# Altium schematic sheet 心电检测与显示电路ascii.SchDoc
size A4
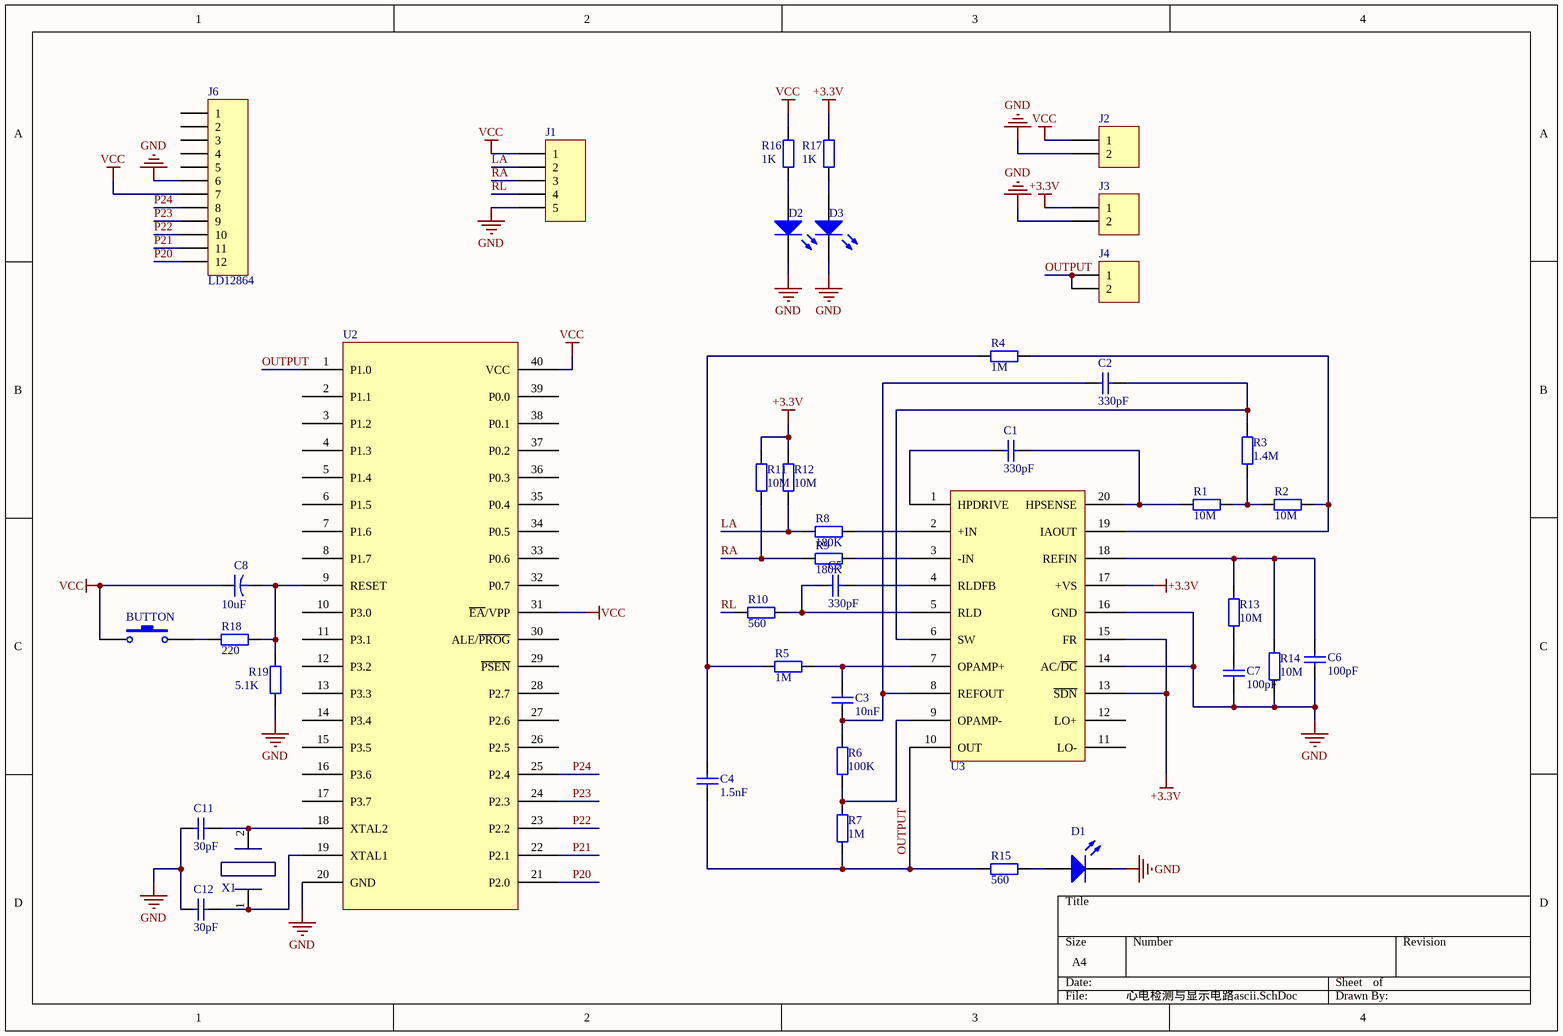
[diagram p0: 心电检测与显示电路ascii.SchDoc]

## Parts
BUTTON  SW-PB  [SPST-2]  (value not drawn)
C1  value 330pF  [RAD-0.3]  (hidden comment: Cap)
C2  value 330pF  [RAD-0.3]  (hidden comment: Cap)
C3  value 10nF  [RAD-0.3]  (hidden comment: Cap)
C4  value 1.5nF  [RAD-0.3]  (hidden comment: Cap)
C5  value 330pF  [RAD-0.3]  (hidden comment: Cap)
C6  value 100pF  [RAD-0.3]  (hidden comment: Cap)
C7  value 100pF  [RAD-0.3]  (hidden comment: Cap)
C8  value 10uF  [CAPR5-4X5]  (hidden comment: Cap2)
C11  value 30pF  [RAD-0.3]  (hidden comment: Cap)
C12  value 30pF  [RAD-0.3]  (hidden comment: Cap)
D1  LED1  [LED-1]  (value not drawn)
D2  LED1  [LED-1]  (value not drawn)
D3  LED1  [LED-1]  (value not drawn)
J1  MICROUSB  [HDR1X5]  (value not drawn)
J2  Header 2  [HDR1X2]  (value not drawn)
J3  Header 2  [HDR1X2]  (value not drawn)
J4  Header 2  [HDR1X2]  (value not drawn)
J6  LD12864  [HDR1X12]
R1  value 10M  [AXIAL-0.4]  (hidden comment: Res2)
R2  value 10M  [AXIAL-0.4]  (hidden comment: Res2)
R3  value 1.4M  [AXIAL-0.4]  (hidden comment: Res2)
R4  value 1M  [AXIAL-0.4]  (hidden comment: Res2)
R5  value 1M  [AXIAL-0.4]  (hidden comment: Res2)
R6  value 100K  [AXIAL-0.4]  (hidden comment: Res2)
R7  value 1M  [AXIAL-0.4]  (hidden comment: Res2)
R8  value 180K  [AXIAL-0.4]  (hidden comment: Res2)
R9  value 180K  [AXIAL-0.4]  (hidden comment: Res2)
R10  value 560  [AXIAL-0.4]  (hidden comment: Res2)
R11  value 10M  [AXIAL-0.4]  (hidden comment: Res2)
R12  value 10M  [AXIAL-0.4]  (hidden comment: Res2)
R13  value 10M  [AXIAL-0.4]  (hidden comment: Res2)
R14  value 10M  [AXIAL-0.4]  (hidden comment: Res2)
R15  value 560  [AXIAL-0.4]  (hidden comment: Res2)
R16  value 1K  [AXIAL-0.4]  (hidden comment: Res2)
R17  value 1K  [AXIAL-0.4]  (hidden comment: Res2)
R18  value 220  [AXIAL-0.4]  (hidden comment: Res2)
R19  value 5.1K  [AXIAL-0.4]  (hidden comment: Res2)
U2  89c51  [89c51]  (value not drawn)
U3  Component_1  [AD8232]  (value not drawn)
X1  Component_1  [LC-HC-49S]  (value not drawn)

## Nets
+3.3V: J3.1 R11.1 R12.1 R17.2 U3.13(~{SDN}) U3.15(FR) U3.17(+VS)
GND: C6.1 C7.1 C11.1 C12.1 D1.2(K) D2.2(K) D3.2(K) J1.5 J2.2 J3.2 J6.6 R14.2 R19.1 U2.20(GND) U3.14(AC/~{DC}) U3.16(GND)
VCC: BUTTON.1 C8.1 J1.1 J2.1 J6.7 R16.2 U2.31(~{EA}/VPP) U2.40(VCC)
LA: J1.2 R8.2 R12.2
OUTPUT: C4.1 J4.1 J4.2 R7.2 R15.2 U2.1(P1.0) U3.10(OUT)
P20: J6.12 U2.21(P2.0)
P21: J6.11 U2.22(P2.1)
P22: J6.10 U2.23(P2.2)
P23: J6.9 U2.24(P2.3)
P24: J6.8 U2.25(P2.4)
RA: J1.3 R9.2 R11.2
RL: J1.4 R10.2
NetBUTTON_2: BUTTON.2 R18.1
NetC1_1: C1.1 U3.1(HPDRIVE)
NetC1_2: C1.2 R1.1 U3.20(HPSENSE)
NetC2_1: C2.1 C3.1 R6.1 U3.8(REFOUT)
NetC2_2: C2.2 R3.2 U3.6(SW)
NetC3_2: C3.2 R5.1 U3.7(OPAMP+)
NetC4_2: C4.2 R4.2 R5.2
NetC5_1: C5.1 R10.1 U3.5(RLD)
NetC5_2: C5.2 U3.4(RLDFB)
NetC6_2: C6.2 R13.1 R14.1 U3.18(REFIN)
NetC7_2: C7.2 R13.2
NetC8_2: C8.2 R18.2 R19.2 U2.9(RESET)
NetC11_2: C11.2 U2.18(XTAL2) X1.2
NetC12_2: C12.2 U2.19(XTAL1) X1.1
NetD1_1: D1.1(A) R15.1
NetD2_1: D2.1(A) R16.1
NetD3_1: D3.1(A) R17.1
NetR1_2: R1.2 R2.1 R3.1
NetR2_2: R2.2 R4.1 U3.19(IAOUT)
NetR6_2: R6.2 R7.1 U3.9(OPAMP-)
NetR8_1: R8.1 U3.2(+IN)
NetR9_1: R9.1 U3.3(-IN)

Not connected (* = marked no-connect by the designer): J6 1 2 3 4 5; U2 2(P1.1) 3(P1.2) 4(P1.3) 5(P1.4) 6(P1.5) 7(P1.6) 8(P1.7) 10(P3.0) 11(P3.1) 12(P3.2) 13(P3.3) 14(P3.4) 15(P3.5) 16(P3.6) 17(P3.7) 26(P2.5) 27(P2.6) 28(P2.7) 29(~{PSEN}) 30(ALE/~{PROG}) 32(P0.7) 33(P0.6) 34(P0.5) 35(P0.4) 36(P0.3) 37(P0.2) 38(P0.1) 39(P0.0); U3 11(LO-) 12(LO+)

## Library data of the parts
BUTTON = SW-PB: Switch; Published: 24-Mar-1999; LatestRevisionDate: 17-Jul-2002; LatestRevisionNote: Re-released for DXP Platform.; PackageReference: SPST-2; Publisher: Altium Limited; PackageDescription: Switch; 2 Leads
C1-C7 C11 C12 = Cap: Capacitor; Published: 8-Jun-2000; LatestRevisionDate: 17-Jul-2002; LatestRevisionNote: Re-released for DXP Platform.; PackageReference: RAD-0.3; Publisher: Altium Limited; PackageDescription: Radial Cap, Thru-Hole; 2 Leads; 0.3 in Pin Spacing
C8 = Cap2: Capacitor; Published: 23-Sep-2002; PackageReference: CAPR5-4X5; Publisher: Altium Limited; PackageDescription: Capacitor; 2 Leads
D1-D3 = LED1: Typical RED GaAs LED; Published: 8-Jun-2000; LatestRevisionDate: 08-Jul-2005; LatestRevisionNote: Mech Layer 1 removed.; PackageReference: LED-1; Publisher: Altium Limited; PackageDescription: LED; 2 Leads
J1 = Header 5: Header, 5-Pin; LatestRevisionDate: 17-Jul-2002; LatestRevisionNote: Re-released for DXP Platform.; Publisher: Altium Limited
J2-J4 = Header 2: Header, 2-Pin; LatestRevisionDate: 17-Jul-2002; LatestRevisionNote: Re-released for DXP Platform.; Publisher: Altium Limited
J6 = Header 12: Header, 12-Pin; LatestRevisionDate: 17-Jul-2002; LatestRevisionNote: Re-released for DXP Platform.; Publisher: Altium Limited
R1-R19 = Res2: Resistor; Published: 8-Jun-2000; LatestRevisionDate: 17-Jul-2002; LatestRevisionNote: Re-released for DXP Platform.; PackageReference: AXIAL-0.4; Publisher: Altium Limited; PackageDescription: Axial Device, Thru-Hole; 2 Leads; 0.4 in Pin Spacing
U2 = Component_1